# Altium schematic sheet DC_Power_Regulation.SchDoc: STM32F412 CNC
size B; Author: AM; CompanyName: Expatria Technologies; DrawnBy: A.Marles; Engineer: AM; Organization: Expatria Technolgoies; Address1: PO Box 2084; Address3: Merritt, BC V1K 1B8; Address4: Canada; DocumentNumber: 19; SheetNumber: 19; SheetTotal: 27
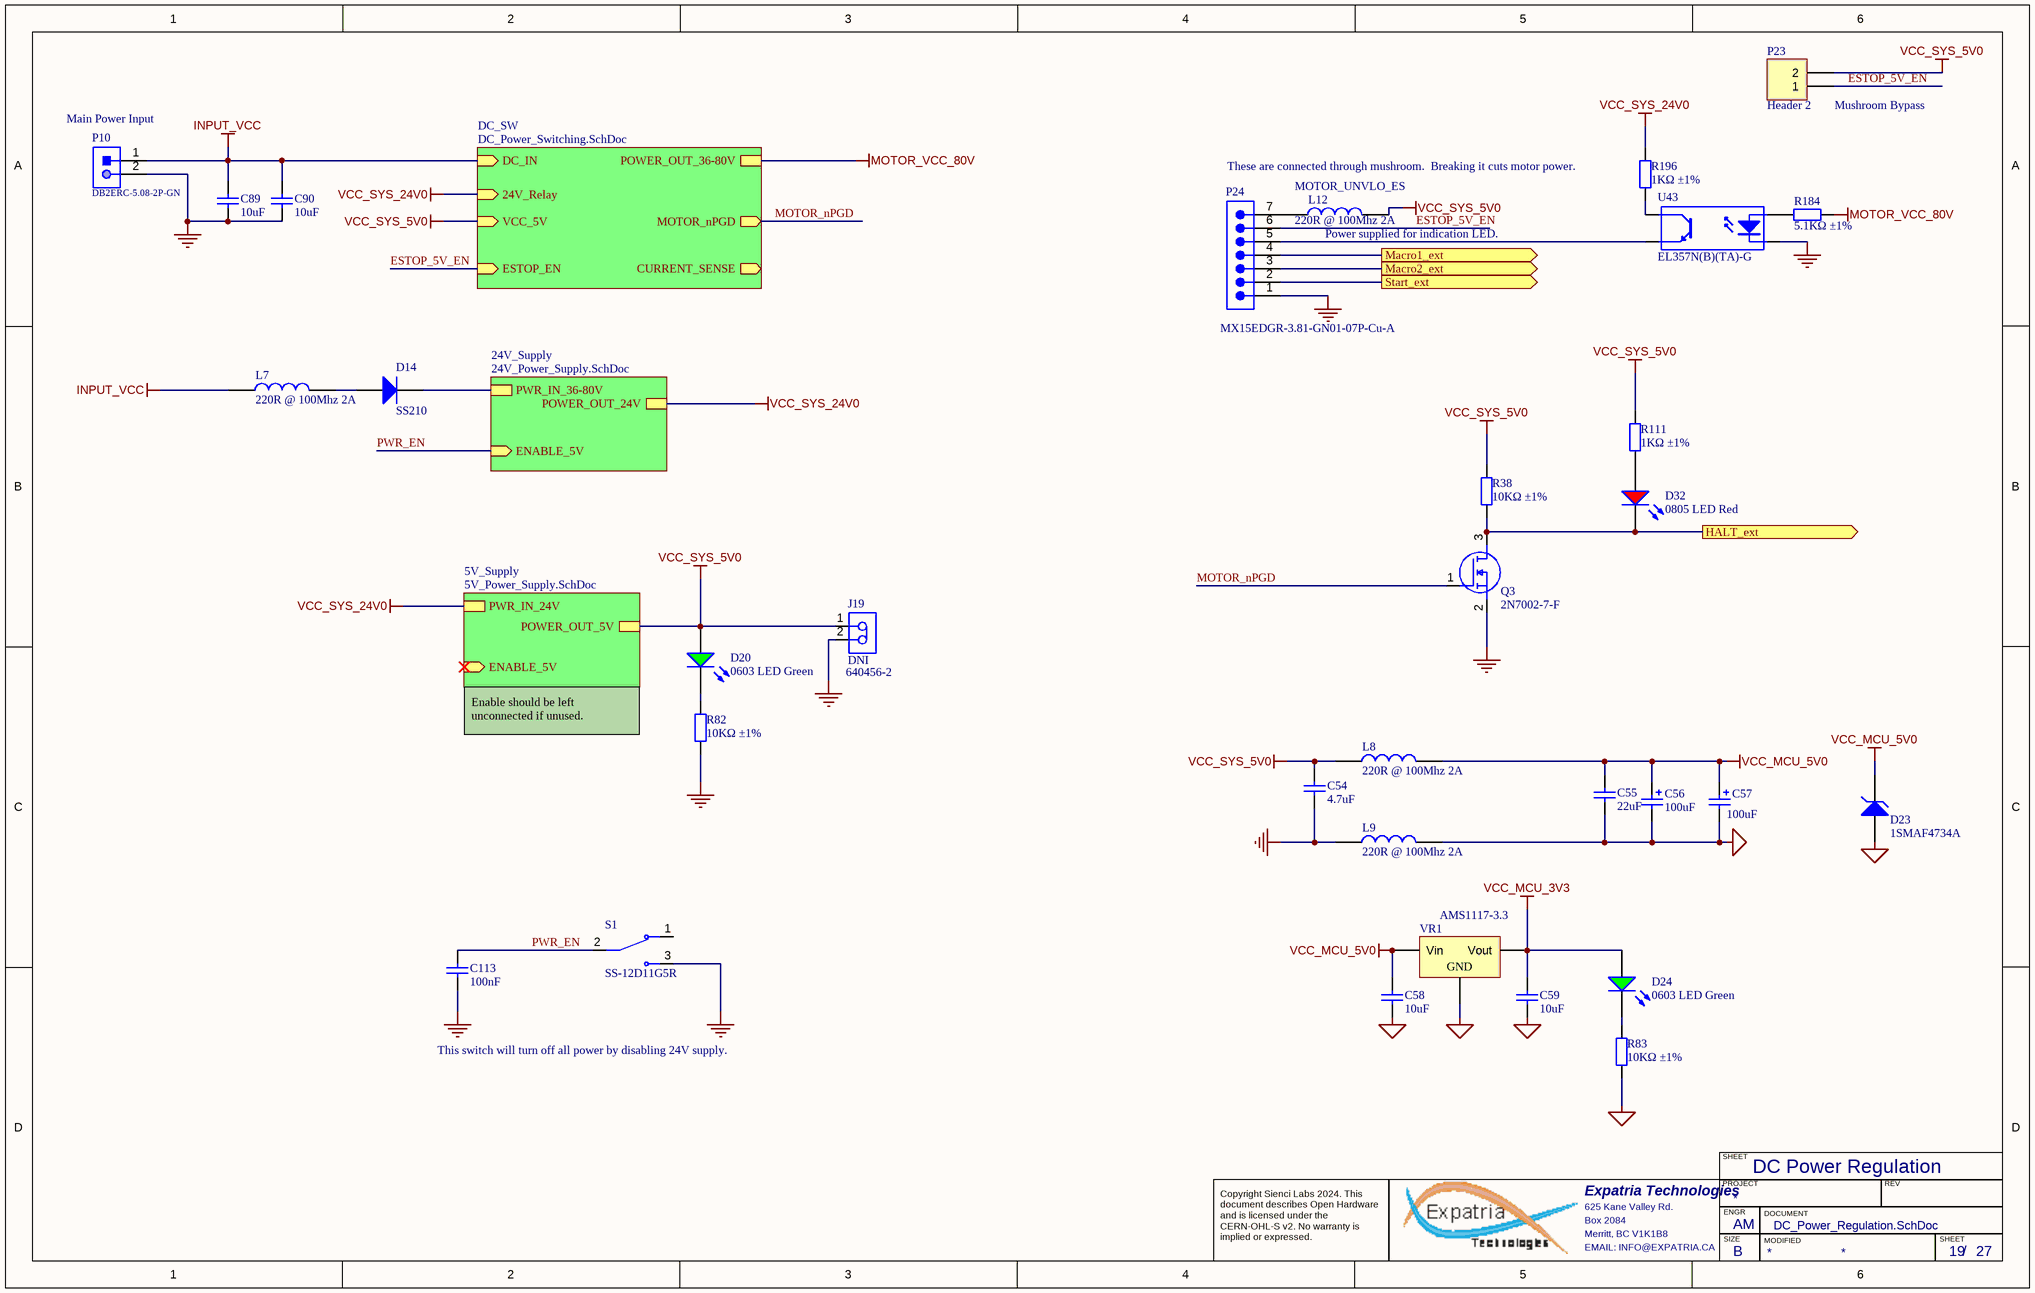
[diagram p0: DC_Power_Regulation.SchDoc]

## Parts
C54  4.7uF  [0603_C]
C55  22uF  [0805_C]
C56  100uF  [CASE-B_3528]
C57  100uF  [WCAP-ASLI_D6.3H7.7]
C58  10uF  [1206_C]
C59  10uF  [1206_C]
C89  10uF  [1206_C]
C90  10uF  [1206_C]
C113  100nF  [0603_C]
D14  SS210  [SMA(DO-214AC)_S1]
D20  0603 LED Green  [0603_LED_S1 - GREEN]
D23  1SMAF4734A  [DIOM5226X240N]
D24  0603 LED Green  [0603_LED_S1 - GREEN]
D32  0805 LED Red  [0805_LED_S1 - RED]
J19  DNI  value 640456-2  [TECO-640456-2_V]
L7  220R @ 100Mhz 2A  [0805_R]
L8  220R @ 100Mhz 2A  [0805_R]
L9  220R @ 100Mhz 2A  [0805_R]
L12  220R @ 100Mhz 2A  [0805_R]
P10  DB2ERC-5.08-2P-GN  [CONN-TH_2P-P5.08_DB2ERC-5.08-2P]
P23  Header 2  [HDR1X2]
P24  MX15EDGR-3.81-GN01-07P-Cu-A  [691322310007]
Q3  2N7002-7-F  [SOT-23(SOT-23-3)]
R38  10KΩ ±1%  [0603_R]
R82  10KΩ ±1%  [0603_R]
R83  10KΩ ±1%  [0603_R]
R111  1KΩ ±1%  [0603_R]
R184  5.1KΩ ±1%  [0603_R]
R196  1KΩ ±1%  [0603_R]
S1  SS-12D11G5R  [SW_500SSP1S1M6QEA]
U43  EL357N(B)(TA)-G  [SOP-4_P2.54]
VR1  AMS1117-3.3  [SOT-223]

## Sub-sheets
5V_Supply = 5V_Power_Supply.SchDoc: POWER_OUT_5V, PWR_IN_24V, ENABLE_5V (in)
24V_Supply = 24V_Power_Supply.SchDoc: ENABLE_5V (in), POWER_OUT_24V, PWR_IN_36-80V
DC_SW = DC_Power_Switching.SchDoc: POWER_OUT_36-80V, DC_IN (in), 24V_Relay (in), VCC_5V (in), MOTOR_nPGD (out), ESTOP_EN (in), CURRENT_SENSE (out)

## Ports
HALT_ext (out), Macro1_ext (out), Macro2_ext (out), Start_ext (out)

## Nets
GND: C54.1 C89.1 C90.1 C113.1 J19.2 L9.1 P10.2 P24.1 Q3.2(S) R82.1 S1.3(NO) U43.2(K)
INPUT_VCC: C89.2 C90.2 L7.1 P10.1 ; sheet DC_SW/DC_IN
MCU_GND: C55.1 C56.2 C57.2(N) C58.1 C59.1 D23.1(A) L9.2 R83.1 VR1.1(GND)
MOTOR_VCC_80V: R184.2 ; sheet DC_SW/POWER_OUT_36-80V
VCC_MCU_3V3: C59.2 D24.A VR1.2(Vout)
VCC_MCU_5V0: C55.2 C56.1 C57.1(P) C58.2 D23.2(K) L8.2 VR1.3(Vin)
VCC_SYS_5V0: C54.2 D20.A J19.1 L8.1 L12.2 P23.2 R38.2 R111.2 ; sheet 5V_Supply/POWER_OUT_5V, sheet DC_SW/VCC_5V
VCC_SYS_24V0: R196.2 ; sheet 5V_Supply/PWR_IN_24V, sheet 24V_Supply/POWER_OUT_24V, sheet DC_SW/24V_Relay
ESTOP_5V_EN: P23.1 P24.6 ; sheet DC_SW/ESTOP_EN
HALT_ext: D32.K Q3.3(D) R38.1 ; port HALT_ext
Macro1_ext: P24.4 ; port Macro1_ext
Macro2_ext: P24.3 ; port Macro2_ext
MOTOR_nPGD: Q3.1(G) ; sheet DC_SW/MOTOR_nPGD
PWR_EN: C113.2 S1.2(COM) ; sheet 24V_Supply/ENABLE_5V
Start_ext: P24.2 ; port Start_ext
NetD14_1: D14.1(A) L7.2
NetD14_2: D14.2(K) ; sheet 24V_Supply/PWR_IN_36-80V
NetD20_K: D20.K R82.2
NetD24_K: D24.K R83.2
NetD32_A: D32.A R111.1
NetL12_1: L12.1 P24.7
NetP24_5: P24.5 U43.3(E)
NetR184_1: R184.1 U43.1(A)
NetR196_1: R196.1 U43.4(C)

Not connected (* = marked no-connect by the designer): S1 1(NC)

## Notes on the sheet
- (near P10) Main Power Input
- (near P23) Mushroom Bypass
- (near R196) These are connected through mushroom.  Breaking it cuts motor power.
- (near L12) MOTOR_UNVLO_ES
- (near L12) Power supplied for indication LED.
- Enable should be left unconnected if unused.
- This switch will turn off all power by disabling 24V supply.
- DC Power Regulation
- SHEET
- Expatria Technologies
- 625 Kane Valley Rd.
- Box 2084
- Merritt, BC V1K1B8
- PROJECT
- SIZE
- ENGR
- MODIFIED
- DOCUMENT
- REV
- Copyright Sienci Labs 2024. This document describes Open Hardware and is licensed under the CERN-OHL-S v2. No warranty is implied or expressed.
- EMAIL: INFO@EXPATRIA.CA
- B
- /

## Library data of the parts
C54 = 0603 4.7uF (475) 10% 16V: 16V 4.7uF X5R ±10% 0603 Multilayer Ceramic Capacitors MLCC - SMD/SMT ROHS; Manufacturer: Samsung Electro-Mechanics; Manufacturer Part Number: CL10A475KO8NNNC; ComponentLink1Description: Supplier link; ComponentLink1URL: http://www.szlcsc.com/product/details_20375.html; Package: 0603; Supplier: LC; SuppliersPartNumber: C19666; Capacitance: 4.7uF; Tolerance: 10%; Voltage: 16V
C55 = 0805 22uF (226) 20% 25V: 25V 22uF X5R ±20% 0805 Multilayer Ceramic Capacitors MLCC - SMD/SMT ROHS; Manufacturer: Samsung Electro-Mechanics; Manufacturer Part Number: CL21A226MAQNNNE; ComponentLink1Description: Supplier link; ComponentLink1URL: http://www.szlcsc.com/product/details_46786.html; Package: 0805; Supplier: LC; SuppliersPartNumber: C45783; Capacitance: 22uF; Tolerance: 20%; Voltage: 25V
C56 = 3528 100uF (107) 10% 6.3V: Tantalum capacitor; Manufacturer: AVX; Manufacturer Part Number: TAJB107K006RNJ; Tolerance: 10%; Voltage: 6.3V; ComponentLink1Description: Supplier link; ComponentLink1URL: http://www.szlcsc.com/product/details_16815.html; Package: 3528; Supplier: LCSC; SuppliersPartNumber: C16133; Capacitance: 100uF
C57 = 865080445010: -45℃~+105℃ 2000hrs@105℃ 100uF 7.7mm 35V 6.3mm ±20% SMD,6.3x7.7mm Aluminum Electrolytic Capacitors - SMD ROHS; Manufacturer: Capxon International Elec; Manufacturer Part Number: HV101M035E077ETR; SuppliersPartNumber: C59934; Value: 100uF; Supplier: LCSC
C58 C59 C89 C90 = 1206 10uF (106) 10% 50V: 50V 10uF X5R ±10% 1206 Multilayer Ceramic Capacitors MLCC - SMD/SMT ROHS; Manufacturer: Samsung Electro-Mechanics; Manufacturer Part Number: CL31A106KBHNNNE; Package: 1206; Supplier: LC; SuppliersPartNumber: C13585; Capacitance: 10uF; Tolerance: 10%; Voltage: 50V
C113 = 0603 100nF (104) 10% 50V: 50V 100nF X7R ±10% 0603 Multilayer Ceramic Capacitors MLCC - SMD/SMT ROHS; Manufacturer: YAGEO; Manufacturer Part Number: CC0603KRX7R9BB104; ComponentLink1Description: Supplier link; ComponentLink1URL: http://www.szlcsc.com/product/details_15331.html; Package: 0603; Supplier: LC; SuppliersPartNumber: C14663; Capacitance: 100nF; Tolerance: 10%; Voltage: 50V
D14 = SMA(DO-214AC) SS210: 100V 2A 850mV @ 2A SMA(DO-214AC) Schottky Barrier Diodes (SBD) ROHS; Manufacturer: MDD(Microdiode Electronics); ComponentLink1Description: 供应商链接; ComponentLink1URL: http://www.szlcsc.com/product/details_15669.html; Package: SMA(DO-214AC); Supplier: LC; SuppliersPartNumber: C14996; Manufacturer Part Number: SS210
D20 D24 = MHT192UGCT: 20mA -40℃~+85℃ 515nm~530nm Emerald 120° 60mW 0603 Light Emitting Diodes (LED) ROHS; Manufacturer: MEIHUA; Package: 0603; Supplier: LC; SuppliersPartNumber: C389519; Color: Green; Manufacturer Part Number: MHT192UGCT
D23 = BZT52C27: 27V ±5% 1W 500nA @ 20.5V SMA(DO-214AC) Zener Diodes RoHS; Manufacturer: Shandong Jingdao Microelectronics; ComponentLink1Description: 供应商链接; ComponentLink1URL: http://www.szlcsc.com/product/details_8541.html; Package: SMAF; Supplier: LCSC; SuppliersPartNumber: C169539; Manufacturer Part Number: 1SMAF4734A
D32 = 0805 LED Red: Red 0805 Light Emitting Diodes (LED) ROHS; Manufacturer: Foshan NationStar Optoelectronics; Manufacturer Part Number: NCD0805R1; Package: 0805; Supplier: LC; SuppliersPartNumber: C84256; Color: Red
J19 = CMP-2000-05417-1: Male Header, Pitch 2.54 mm, 1 x 2 Position, Height 10.49 mm, Tail Length 3.556 mm, -55 to 105 degC, RoHS, Bulk; Manufacturer: TE Connectivity; Standards: RoHSCompliant,ELVCompliant,UL94V-0; Material, Housing: Polyester; Agency Approvals: CSA,UL; Brand/Series: MTA-100Series; Contact Centerline Spacing: 0.100 / in.; Material, Contact: CopperAlloy; Current, Rating: 5 / A; Color, Housing: White; Contact Termination Area Plating: Tin; Special Features: Pinstrip; Number of Positions: 2; Pin Spacing: 0.1 / "; Temperature, Operating: -55to+105 / degC; Angle: Straight; Mount Angle: Vertical; Connector Type: MTA-100; Primary Type: InterconnectSystem; Voltage, Rating: 250 / V; Mounting Hole Size: 0.04 / "; Number of Rows: 1; Termination: Solder; Length, Terminal Post: 0.14 / in.; Manufacturer URL: http://www.te.com/; Color: White; Size, Post: 0.025 / in.; Contact Shape: Square; Mounting Type: PCMount; Datasheet URL: https://datasheet.ciiva.com/11746/0900766b80eb7fdd-11746365.pdf; Type: PCBPlug; Datasheet Version: Rev. W, 06/2004; Number of Contacts: 2; Flammability Rating: UL94V-0; Contact Plating: Tin; Length, Pin: 0.14 / "; Contact Mating Area Plating: Tin; Length, Overall: 0.2 / "; SuppliersPartNumber: C86502
L7-L9 L12 = CBW201209U221T: 150mΩ ±25% 220Ω@100MHz 0805 Ferrite Beads ROHS; Manufacturer: FH (Guangdong Fenghua Advanced Tech); Manufacturer Part Number: CBW201209U221T; Package: 0402; Supplier: LC; SuppliersPartNumber: C139188
P10 = DB2ERC-5.08-2P-GN: 320V 20A 2 Bend -40℃~+105℃ 1 5.08mm 1x2P Green Board Edge/Receptacle-Close Push-Pull,P=5.08mm Pluggable System Terminal Block ROHS; Manufacturer: Dibo; Supplier 1: LCSC; Supplier Part Number 1: C395737; Manufacturer Part Number: DB2ERC-5.08-2P-GN; RoHS: Yes; Category: Terminals; SuppliersPartNumber: C395737
P23 = Header 2: Straight Square Pins 2 2.54mm Black Brass 1x2P Plugin,P=2.54mm Pin Headers ROHS; Manufacturer: MOLEX; Manufacturer Part Number: 22284020; Publisher: Altium Limited; LatestRevisionDate: 17-Jul-2002; LatestRevisionNote: Re-released for DXP Platform.; SuppliersPartNumber: C234182; Supplier 1: LCSC; Supplier Part Number 1: C234182
P24 = MX15EDGR-3.81-GN01-07P-Cu-A: 300V 8A 7 Bend -40℃~+105℃ 1 3.81mm 1x7P Green Board Edge/Receptacle-Close Push-Pull,P=3.81mm Pluggable System Terminal Block ROHS; Manufacturer: MAX; Manufacturer Part Number: MX15EDGR-3.81-GN01-07P-Cu-A; SuppliersPartNumber: C5188162
Q3 = 2N7002-7-F: 60V 115mA 7.5Ω@5V,50mA 370mW N Channel SOT-23 MOSFETs ROHS; Manufacturer: Diodes Inc.; SuppliersPartNumber: C85049; Manufacturer Part Number: 2N7002-7-F; Value: 2N7002-7-F; Datasheet Link: https://datasheet.datasheetarchive.com/originals/distributors/SFDatasheet-0/sf-0003625.pdf; Height: 1.2mm; Manufacturer_Part_Number: 2N7002-7-F; Mouser Part Number: 621-2N7002-F; Mouser Price/Stock: https://www.mouser.co.uk/ProductDetail/Diodes-Incorporated/2N7002-7-F?qs=jMXWnm70%252BC%252BAX%252BMLzUkTZg%3D%3D; Arrow Part Number: 2N7002-7-F; Arrow Price/Stock: https://www.arrow.com/en/products/2n7002-7-f/diodes-incorporated?region=nac
R38 R82 R83 = 0603 10K (1002) 1%: Chip resistor; Manufacturer: Uniroyal Elec; Manufacturer Part Number: 0603WAF1002T5E; Power: 1/10W; ComponentLink1Description: Supplier link; ComponentLink1URL: http://www.szlcsc.com/product/details_26547.html; Package: 0603; Supplier: LC; SuppliersPartNumber: C25804; Resistance: 10KΩ; Tolerance: 1%
R111 R196 = 0603 1K (1001) 1%: Chip resistor; Manufacturer: Uniroyal Elec; Manufacturer Part Number: 0603WAF1001T5E; Power: 1/10W; ComponentLink1Description: Supplier link; ComponentLink1URL: http://www.szlcsc.com/product/details_21904.html; Package: 0603; Supplier: LC; SuppliersPartNumber: C21190; Resistance: 1KΩ; Tolerance: 1%
R184 = 0603 5.1K (5101) 1%: Chip resistor; Manufacturer: Uniroyal Elec; Manufacturer Part Number: 0603WAF5101T5E; Power: 1/10W; ComponentLink1Description: Supplier link; ComponentLink1URL: http://www.szlcsc.com/product/details_23913.html; Package: 0603; Supplier: LC; SuppliersPartNumber: C23186; Resistance: 5.1KΩ; Tolerance: 1%
S1 = SS-12D11G5R: Shrouded 5A SPDT 125V 125V 5A 10000次 Black Plugin Slide Switches ROHS; Manufacturer: XKB Connectivity; SuppliersPartNumber: C388633; Manufacturer Part Number: SS-12D11G5R
U43 = EL357N(B)(TA)-G_[C6649]: Optocoupler SOP-4, EL357N(B)(TA)-G, Everlight Electronics; Package: SOP-4_P2.54; Supplier: LC; SuppliersPartNumber: C6649; Manufacturer: Everlight; Manufacturer Part Number: EL357N(B)(TA)-G
VR1 = SOT-223 AMS1117-3.3: Vout=3.3V 1A 72dB@(120Hz) (LDO); Manufacturer 1: AMS; ComponentLink1Description: 供应商链接; ComponentLink1URL: http://www.szlcsc.com/product/details_6652.html; Package: SOT-223; Supplier: LCSC; SuppliersPartNumber: C6186; Manufacturer Part Number 1: AMS1117-3.3; Manufacturer: AMS; Manufacturer Part Number: AMS1117-3.3